# EAGLE design RocketFlightComputer (EAGLE 9.6.2)
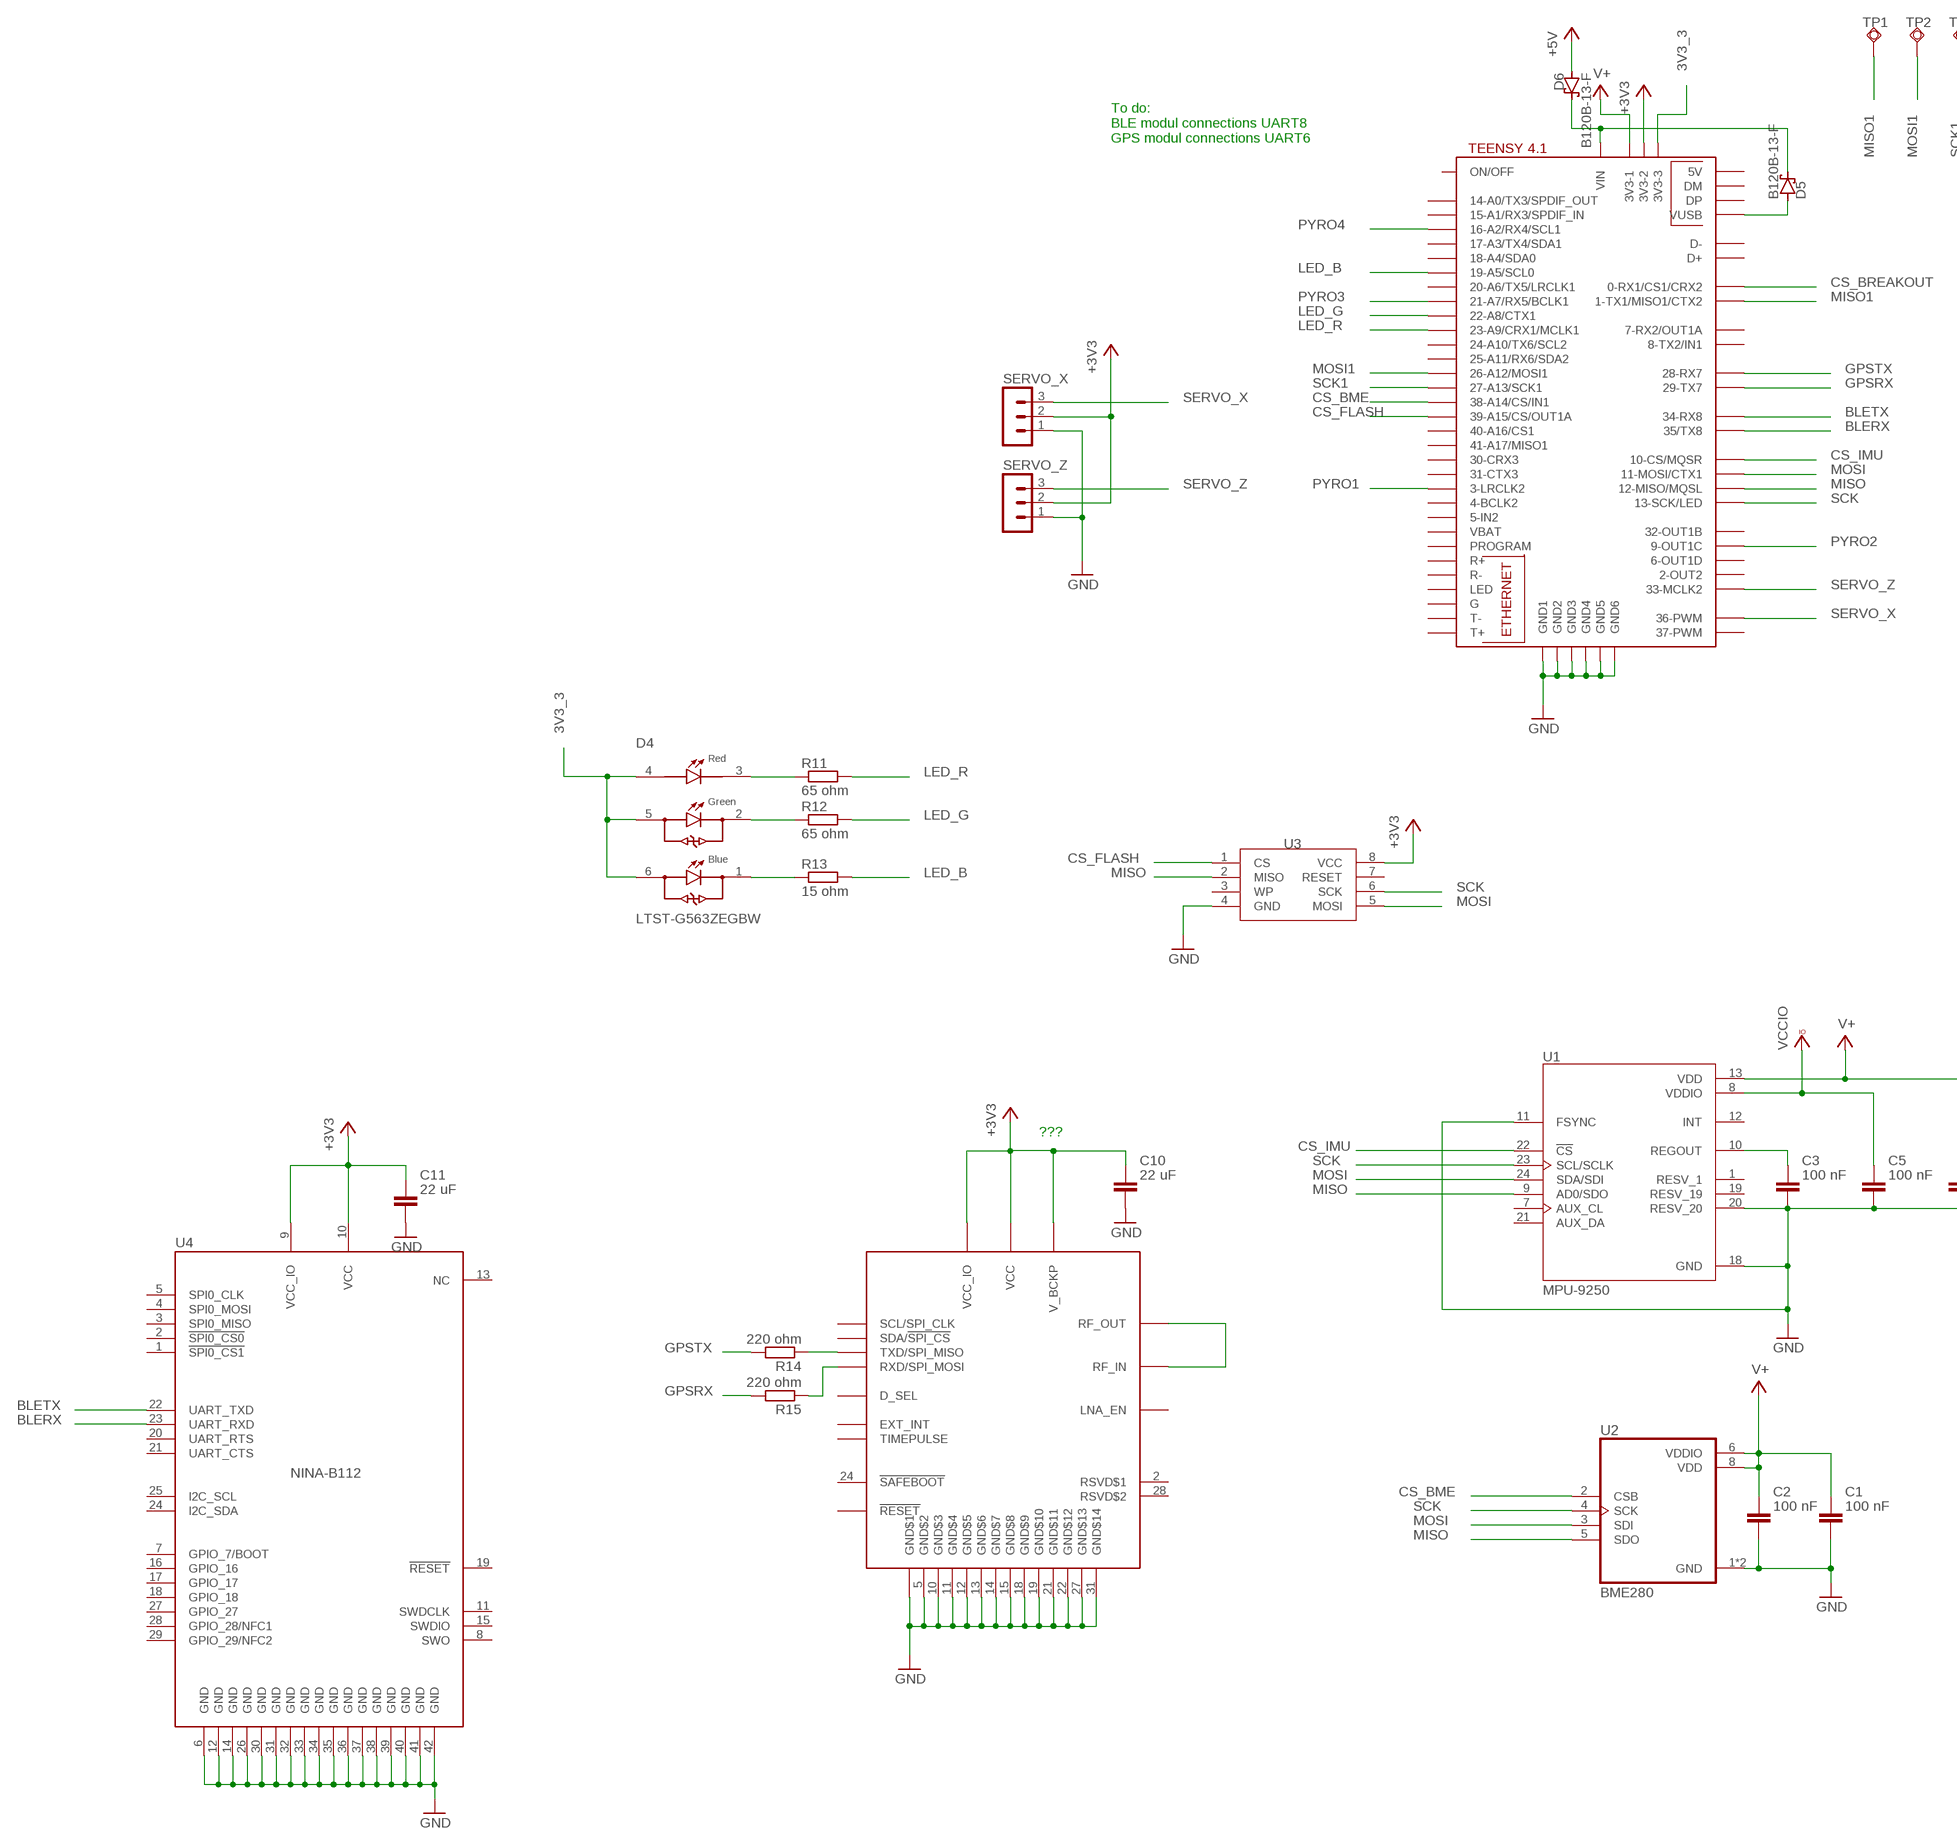
[diagram p0: schematic, sheet 1, part 1 of 2]
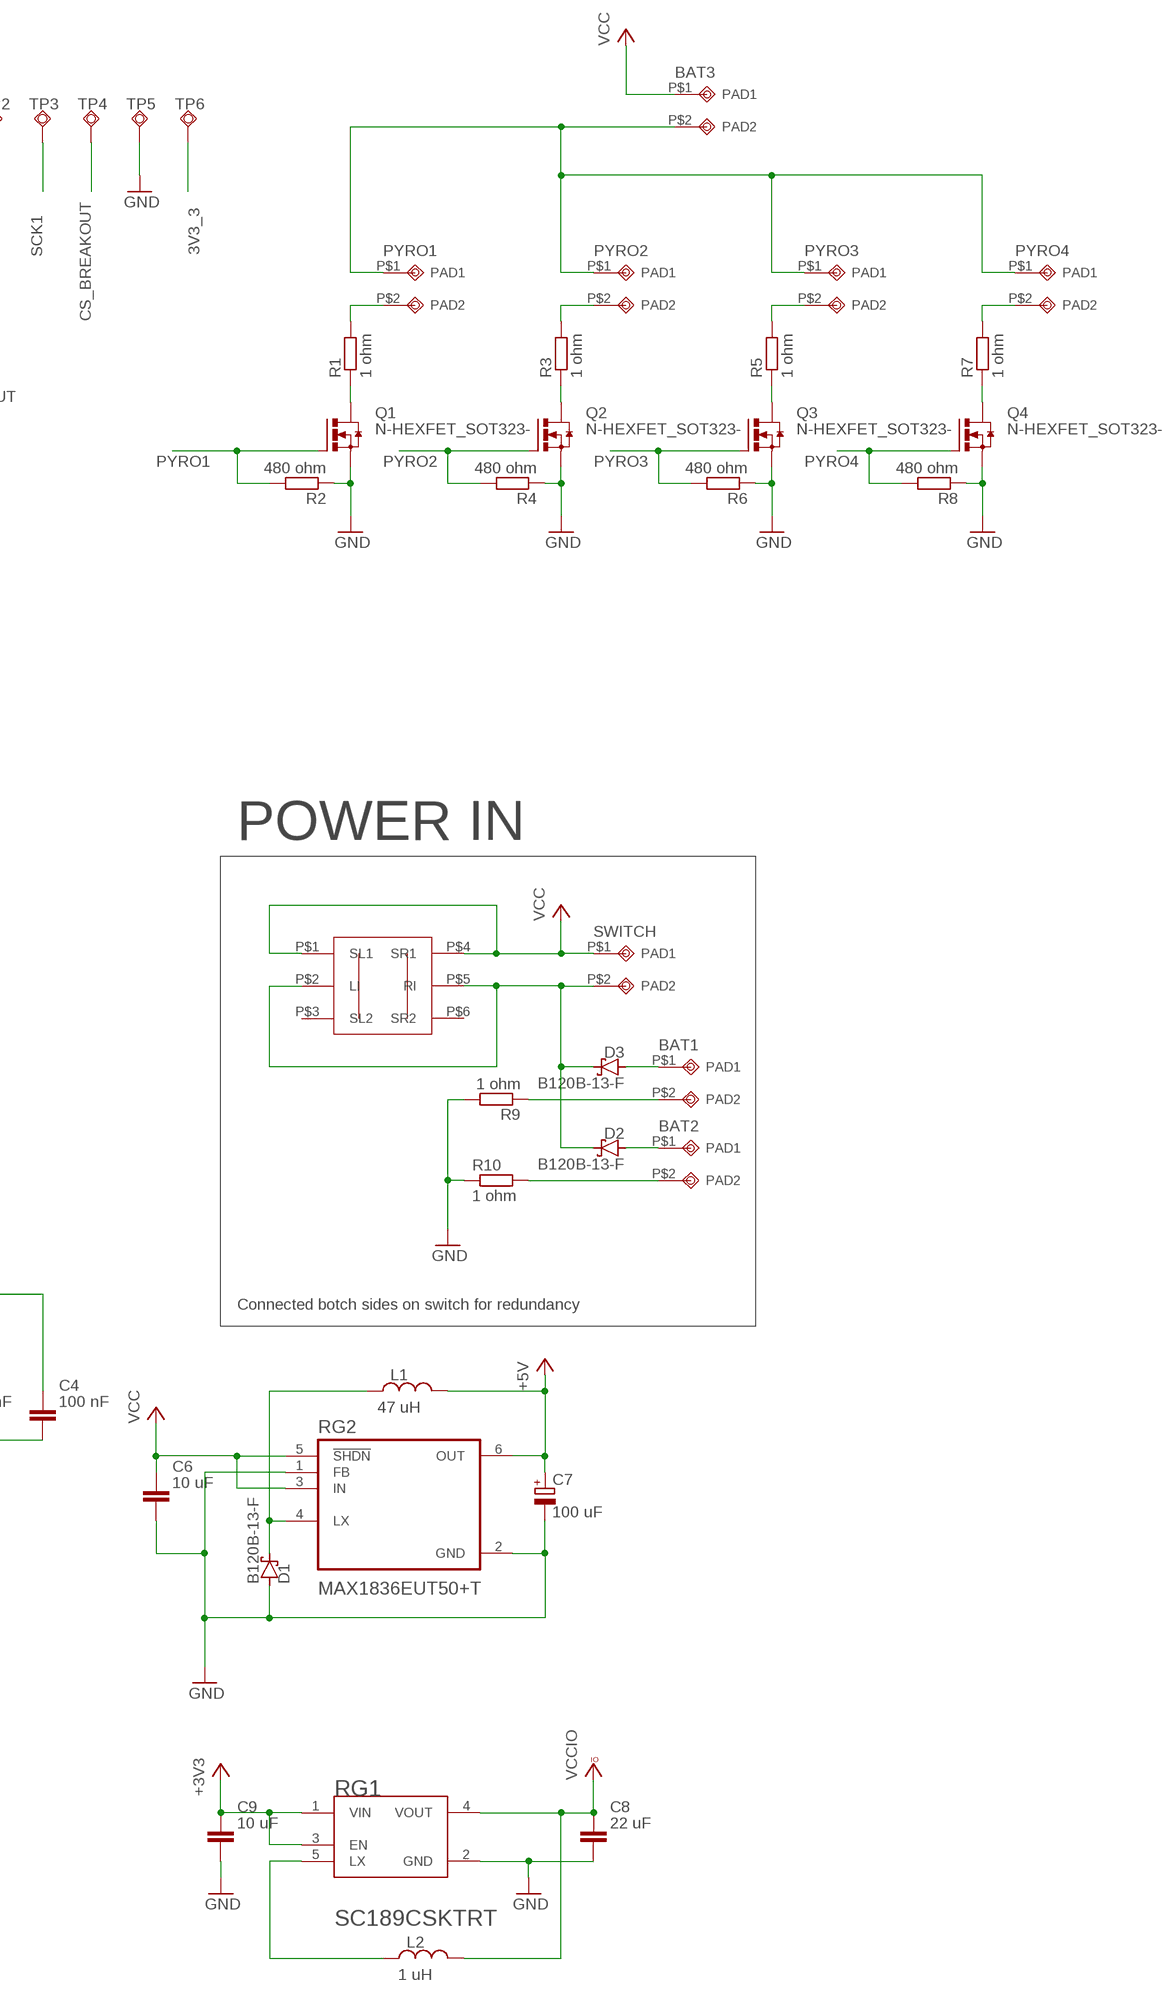
[diagram p1: schematic, sheet 1, part 2 of 2]

## Parts
BAT1  2PINPAD  [2PINPAD]
BAT2  2PINPAD  [2PINPAD]
BAT3  2PINPAD  [2PINPAD]
C1  100 nF  C_CHIP-1206(3216-METRIC)  [CAPC3216X135]
C2  100 nF  C_CHIP-1206(3216-METRIC)  [CAPC3216X135]
C3  100 nF  C_CHIP-1206(3216-METRIC)  [CAPC3216X135]
C4  100 nF  C_CHIP-1206(3216-METRIC)  [CAPC3216X135]
C5  100 nF  C_CHIP-1206(3216-METRIC)  [CAPC3216X135]
C6  10 uF  C_CHIP-1206(3216-METRIC)  [CAPC3216X135]
C7  100 uF  CPOL-EUB/3528-21W  [B/3528-21W]
C8  22 uF  C_CHIP-1206(3216-METRIC)  [CAPC3216X135]
C9  10 uF  C_CHIP-1206(3216-METRIC)  [CAPC3216X135]
C10  22 uF  C_CHIP-1206(3216-METRIC)  [CAPC3216X135]
C11  22 uF  C_CHIP-1206(3216-METRIC)  [CAPC3216X135]
D1  B120B-13-F  [SMB]
D2  B120B-13-F  [SMB]
D3  B120B-13-F  [SMB]
D4  LTST-G563ZEGBW  [LED_LTST-G563ZEGBW]
D5  B120B-13-F  [SMB]
D6  B120B-13-F  [SMB]
L1  47 uH  L_MOLDED-1210(3225-METRIC)  [INDM3225X240]
L2  1 uH  CW0805-10002012  [CAPC2012X110]
PYRO1  2PINPAD  [2PINPAD]
PYRO2  2PINPAD  [2PINPAD]
PYRO3  2PINPAD  [2PINPAD]
PYRO4  2PINPAD  [2PINPAD]
Q1  N-HEXFET_SOT323-  [SOT223]
Q2  N-HEXFET_SOT323-  [SOT223]
Q3  N-HEXFET_SOT323-  [SOT223]
Q4  N-HEXFET_SOT323-  [SOT223]
R1  1 ohm  RR1206  [R1206]
R2  480 ohm  RR1206  [R1206]
R3  1 ohm  RR1206  [R1206]
R4  480 ohm  RR1206  [R1206]
R5  1 ohm  RR1206  [R1206]
R6  480 ohm  RR1206  [R1206]
R7  1 ohm  RR1206  [R1206]
R8  480 ohm  RR1206  [R1206]
R9  1 ohm  RR1206  [R1206]
R10  1 ohm  RR1206  [R1206]
R11  65 ohm  RR1206  [R1206]
R12  65 ohm  RR1206  [R1206]
R13  15 ohm  RR1206  [R1206]
R14  220 ohm  RR1206  [R1206]
R15  220 ohm  RR1206  [R1206]
RG1  SEMTECH_SC189CSKTRTSEMTECH_SC189CSKTRT_0_0  [SEMTECH_SC189CSKTRT_0]
RG2  MAX1836EUT50+T  [SOT95P280X145-6N]
SERVO_X  MA03-1  [MA03-1]
SERVO_Z  MA03-1  [MA03-1]
SWITCH  2PINPAD  [2PINPAD]
TP1  TPSQTP13SQ  [TP13SQ]
TP2  TPSQTP13SQ  [TP13SQ]
TP3  TPSQTP13SQ  [TP13SQ]
TP4  TPSQTP13SQ  [TP13SQ]
TP5  TPSQTP13SQ  [TP13SQ]
TP6  TPSQTP13SQ  [TP13SQ]
U1  MPU-9250  [QFN40P300X300X105-24N]
U2  BME280  [PSON65P250X250X100-8N]
U3  FLASHSOIC8  [SOIC127P600X175-8N]
U4  NINA-B112  [NINA112-42]
U$1  TEENSY41  [TEENSY41]
U$2  CAM-M8  [CAM-M8]
U$3  DUAL_SW  [DUAL_SWITCH]

## Nets
3V3_3: D4.4 D4.5 D4.6 TP6.TP U$1.3V3-3
+3V3: C9.1 C10.1 C11.1 RG1.1(VIN) RG1.3(EN) SERVO_X.2 SERVO_Z.2 U3.8(VCC) U4.9(VCC_IO) U4.10(VCC) U$1.3V3-2 U$2.1(VCC_IO) U$2.8(V_BCKP) U$2.9(VCC)
+5V: C7.+ D6.P$2(A) L1.2 RG2.6(OUT)
BLERX: U4.23(UART_RXD) U$1.35-TX8(35/TX8)
BLETX: U4.22(UART_TXD) U$1.34-RX8
CS_BME: U2.2(CSB) U$1.38-A14/CS/IN1
CS_BREAKOUT: TP4.TP U$1.0-RX1/CS1/CRX2
CS_FLASH: U3.1(CS) U$1.39-A15/CS/OUT1A
CS_IMU: U1.22(!CS) U$1.10-CS\MQSR(10-CS/MQSR)
GND: C1.2 C2.2 C3.2 C4.2 C5.2 C6.2 C7.- C8.2 C9.2 C10.2 C11.2 D1.P$2(A) Q1.3(S) Q2.3(S) Q3.3(S) Q4.3(S) R2.1 R4.1 R6.1 R8.1 R9.2 R10.1 RG1.2(GND) RG2.1(FB) RG2.2(GND) SERVO_X.1 SERVO_Z.1 TP5.TP U1.11(FSYNC) U1.18(GND) U1.20(RESV_20) U2.1(GND) U2.7(GND) U3.4(GND) U4.6(GND) U4.12(GND) U4.14(GND) U4.26(GND) U4.30(GND) U4.31(GND) U4.32(GND) U4.33(GND) U4.34(GND) U4.35(GND) U4.36(GND) U4.37(GND) U4.38(GND) U4.39(GND) U4.40(GND) U4.41(GND) U4.42(GND) U$1.GND1 U$1.GND2 U$1.GND3 U$1.GND4 U$1.GND5 U$1.GND6 U$2.4(GND$1) U$2.5(GND$2) U$2.10(GND$3) U$2.11(GND$4) U$2.12(GND$5) U$2.13(GND$6) U$2.14(GND$7) U$2.15(GND$8) U$2.18(GND$9) U$2.19(GND$10) U$2.21(GND$11) U$2.22(GND$12) U$2.27(GND$13) U$2.31(GND$14)
GPSRX: R15.2 U$1.29-TX7
GPSTX: R14.2 U$1.28-RX7
LED_B: R13.2 U$1.19-A5/SCL0
LED_G: R12.2 U$1.22-A8/CTX1
LED_R: R11.2 U$1.23-A9/CRX1/MCLK1
MISO: U1.9(AD0/SDO) U2.5(SDO) U3.2(MISO) U$1.12-MISO/MQSL
MISO1: TP1.TP U$1.1-TX1/MISO1/CTX2
MOSI: U1.24(SDA/SDI) U2.3(SDI) U3.5(MOSI) U$1.11-MOSI/CTX1
MOSI1: TP2.TP U$1.26-A12/MOSI1
N$1: C3.1 U1.10(REGOUT)
N$2: D5.P$1(B) D6.P$1(B) U$1.VIN
N$3: Q1.4(D) R1.1
N$4: PYRO1.P$2(PAD2) R1.2
N$5: Q2.4(D) R3.1
N$6: PYRO2.P$2(PAD2) R3.2
N$7: D2.P$1(B) D3.P$1(B) SWITCH.P$2(PAD2) U$3.P$2(LI) U$3.P$5(RI)
N$8: D4.3 R11.1
N$9: Q3.4(D) R5.1
N$10: PYRO3.P$2(PAD2) R5.2
N$11: D4.2 R12.1
N$12: Q4.4(D) R7.1
N$13: PYRO4.P$2(PAD2) R7.2
N$14: BAT1.P$2(PAD2) R9.1
N$15: BAT2.P$2(PAD2) R10.2
N$16: D4.1 R13.1
N$17: D1.P$1(B) L1.1 RG2.4(LX)
N$18: BAT2.P$1(PAD1) D2.P$2(A)
N$19: BAT1.P$1(PAD1) D3.P$2(A)
N$20: D5.P$2(A) U$1.VUSB
N$21: U$2.16(RF_OUT) U$2.17(RF_IN)
N$22: L2.1 RG1.5(LX)
N$23: BAT3.P$2(PAD2) PYRO1.P$1(PAD1) PYRO2.P$1(PAD1) PYRO3.P$1(PAD1) PYRO4.P$1(PAD1)
N$24: R14.1 U$2.25(TXD/SPI_MISO)
N$25: R15.1 U$2.26(RXD/SPI_MOSI)
PYRO1: Q1.1(G) R2.2 U$1.3-LRCLK2
PYRO2: Q2.1(G) R4.2 U$1.9-OUT1C
PYRO3: Q3.1(G) R6.2 U$1.21-A7/RX5/BCLK1
PYRO4: Q4.1(G) R8.2 U$1.16-A2/RX4/SCL1
SCK: U1.23(SCL/SCLK) U2.4(SCK) U3.6(SCK) U$1.13-SCK/LED
SCK1: TP3.TP U$1.27-A13/SCK1
SERVO_X: SERVO_X.3 U$1.36-PWM
SERVO_Z: SERVO_Z.3 U$1.33-MCLK2
V+: C1.1 C2.1 C4.1 U1.13(VDD) U2.6(VDDIO) U2.8(VDD) U$1.3V3-1
VCC: BAT3.P$1(PAD1) C6.1 RG2.3(IN) RG2.5(!SHDN) SWITCH.P$1(PAD1) U$3.P$1(SL1) U$3.P$4(SR1)
VCCIO: C5.1 C8.1 L2.2 RG1.4(VOUT) U1.8(VDDIO)
Unconnected: U1.1(RESV_1) U1.7(AUX_CL) U1.12(INT) U1.19(RESV_19) U1.21(AUX_DA) U3.3(WP) U3.7(RESET) U4.1(!SPI0_CS1!) U4.2(!SPI0_CS0) U4.3(SPI0_MISO) U4.4(SPI0_MOSI) U4.5(SPI0_CLK) U4.7(GPIO_7/BOOT) U4.8(SWO) U4.11(SWDCLK) U4.13(NC) U4.15(SWDIO) U4.16(GPIO_16) U4.17(GPIO_17) U4.18(GPIO_18) U4.19(!RESET) U4.20(UART_RTS) U4.21(UART_CTS) U4.24(I2C_SDA) U4.25(I2C_SCL) U4.27(GPIO_27) U4.28(GPIO_28/NFC1) U4.29(GPIO_29/NFC2) U$1.2-OUT2 U$1.4-BCLK2 U$1.5-IN2 U$1.6-OUT1D U$1.7-RX2/OUT1A U$1.8-TX2/IN1 U$1.14-A0/TX3/SPDIF_OUT U$1.15-A1/RX3/SPDIF_IN U$1.17-A3/TX4/SDA1 U$1.18-A4/SDA0 U$1.20-A6/TX5/LRCLK1 U$1.24-A10/TX6/SCL2 U$1.25-A11/RX6/SDA2 U$1.30-CRX3 U$1.31-CTX3 U$1.32-OUT1B U$1.37-PWM U$1.40-A16/CS1 U$1.41-A17/MISO1 U$1.+5V(5V) U$1.D+ U$1.D- U$1.DM U$1.DP U$1.G U$1.LED U$1.ON/OFF U$1.PROGRAM U$1.R+ U$1.R- U$1.T+ U$1.T- U$1.VBAT U$2.2(RSVD$1) U$2.3(SDA/!SPI_CS) U$2.6(SCL/SPI_CLK) U$2.7(EXT_INT) U$2.20(D_SEL) U$2.23(!RESET) U$2.24(!SAFEBOOT) U$2.28(RSVD$2) U$2.29(TIMEPULSE) U$2.30(LNA_EN) U$3.P$3(SL2) U$3.P$6(SR2)

## Notes on the sheet
- To do:
  BLE modul connections UART8
  GPS modul connections UART6
- POWER IN
- Connected botch sides on switch for redundancy
- ???

## Library data of the parts
BAT1-BAT3 PYRO1-PYRO4 SWITCH = SolderPads:2PINPAD: 2x SMD solder pad 0,5 mm x 1 mm
C1-C6 C8-C11 = Capacitor:C: Capacitor - Generic; CATEGORY: Capacitor
C7 = rcl:CPOL-EU: POLARIZED CAPACITOR, European symbol; SPICEPREFIX: C
D1-D3 D5 D6 = DroneCustomParts:B120B-13-F
D4 = LTST-G563ZEGBW:LTST-G563ZEGBW: LED; SMD; 5050, PLCC6; RGB; 5x5x1.6mm; 120°; 20mA; Lens: transparent Check prices <https://pricing.snapeda.com/parts/LTST-G563ZEGBW/Lite-On/view-part?ref=eda>; AVAILABILITY: In Stock; DESCRIPTION: LED; SMD; 5050, PLCC6; RGB; 5x5x1.6mm; 120°; 20mA; Lens: transparent; MF: Lite-On; MP: LTST-G563ZEGBW; PACKAGE: PLCC-6 Lite-On; PRICE: None
L1 = Inductor:L: Inductor Fixed - Generic; CATEGORY: Inductor; SUB-CATEGORY: Fixed
L2 = CW0805-1000:CW0805-1000
Q1-Q4 = transistor-power:N-HEXFET_?-*: HEXFET® Power MOSFET
R1-R15 = eagle-ltspice:R: RESISTOR, European symbol; SPICEMODEL: NONE; SPICEPREFIX: R
RG1 = Semtech - SC189CSKTRT:SEMTECH_SC189CSKTRT: 2.5MHz, 1.5A Synchronous Step Down Regulator; CENTROID_NOT_SPECIFIED: No; DATASHEET: http://www.semtech.com/images/datasheet/sc189.pdf; DIGIKEY_DESCRIPTION: REG IC REG BUCK 1.2V 1.5A SYNC SOT23; DIGIKEY_PART_NUMBER: SC189CSKCT-ND; LEAD_FREE: yes; MF: Semtech; MOUSER_PART_NUMBER: 947-SC189CSKTRT; MPN: SC189CSKTRT; PACKAGE: SOT23-5; PREFIX: RG; ROHS: yes; TEMPERATURE_RANGE_HIGH: +85°C; TEMPERATURE_RANGE_LOW: -40°C
RG2 = MAX1836EUT50_T:MAX1836EUT50+T: Check prices <https://pricing.snapeda.com/parts/MAX1836EUT50%2BT/Maxim%20Integrated/view-part?ref=eda>; AVAILABILITY: In Stock; DESCRIPTION: Buck Switching Regulator IC Positive Fixed 5V 1 Output 125mA SOT-23-6; MF: Maxim Integrated; MP: MAX1836EUT50+T; PACKAGE: SOT-23-6 Maxim; PRICE: None; PURCHASE-URL: https://pricing.snapeda.com/search/part/MAX1836EUT50+T/?ref=eda
SERVO_X SERVO_Z = con-lstb:MA03-1: PIN HEADER; OC_FARNELL: unknown; OC_NEWARK: unknown
TP1-TP6 = testpad:TPSQ: Test pad
U1 = MPU-9250:MPU-9250: Axis=3 Axis Gyro+3 Axis Accel+Compass. Pin For Pin With m Check prices <https://pricing.snapeda.com/parts/MPU-9250/TDK%20InvenSense/view-part?ref=eda>; AVAILABILITY: Bad; DESCRIPTION: Accelerometer, Gyroscope, Magnetometer, 9 Axis Sensor I²C, SPI Output; MF: TDK InvenSense; MP: MPU-9250; PACKAGE: TFQFN-24 TDK InvenSense; PRICE: None
U2 = BME280:BME280: DIGITAL HUMIDITY, PRESSURE AND TEMPERATURE SENSOR * Digital interface I²C (up to 3.4 MHz) and SPI (3 and 4 wire, up to 10 MHz)* Supply voltage VDD main supply voltage range: 1.71 V to 3.6 V*VDDIO interface voltage range: 1.2 V to 3.6 V Operating range -40…+85 °C, 0…100 % rel. humidity, 300…1100 hPa The library has been designed by Richard Magdycz <https://www.facebook.com/groups/eaglecadsoftUK> Check prices <https://pricing.snapeda.com/parts/BME280/Bosch/view-part?ref=eda>; AVAILABILITY: Good; DESCRIPTION: Humidity Temperature Sensor 0 ~ 100% RH I²C, SPI ±3% 1s Surface Mount; MF: Bosch; MP: BME280; PACKAGE: LGA-8 Bosch; PRICE: None; PURCHASE-URL: https://pricing.snapeda.com/search/part/BME280/?ref=eda
U3 = Flahs:FLASH
U4 = ubloxLib:NINA-B112: NINA-B112: BLE stand-alone module u-blox.com
U$1 = teensy:TEENSY41
U$2 = ubloxLib:CAM-M8: CAM-M8x: M8 Concurrent GNSS Antenna Module u-blox.com
U$3 = switch:DUAL_SW

## Board
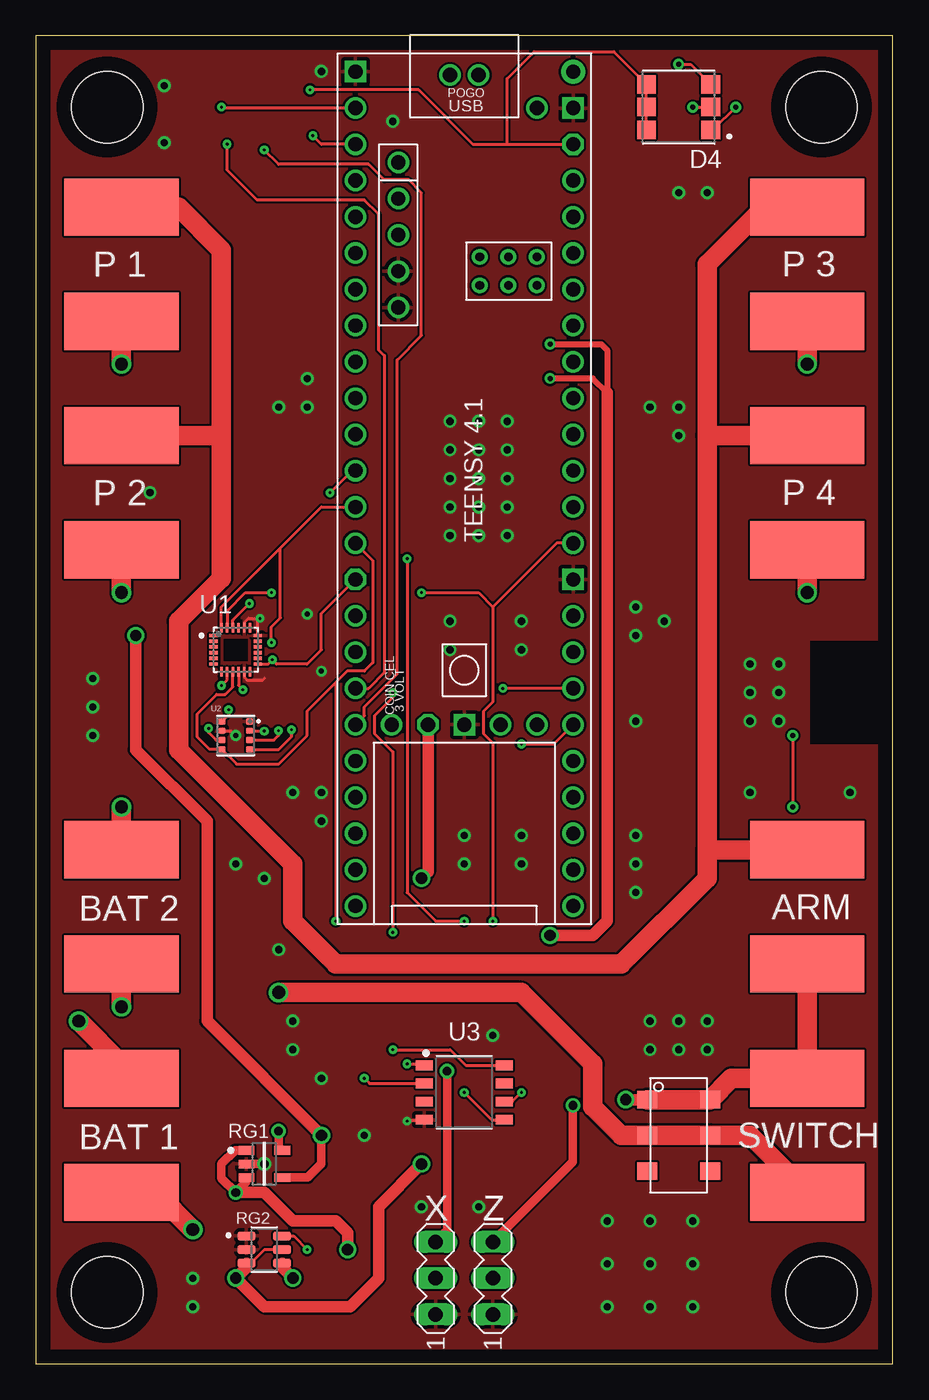
[diagram p2: board, top side]
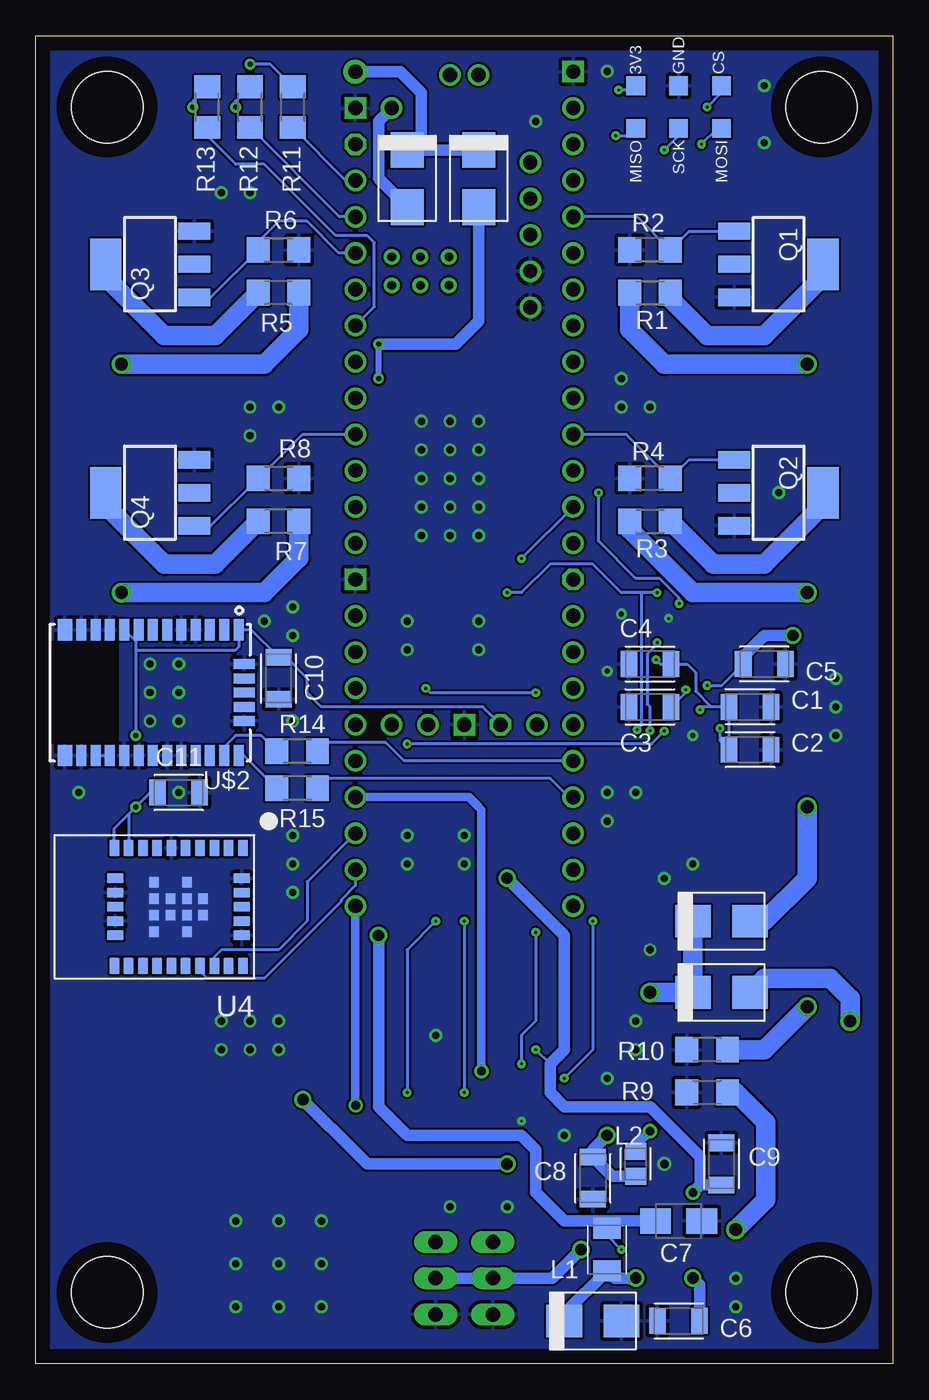
[diagram p3: board, bottom side, seen from below]

Size 60 x 93 mm. Coordinates in mm from the lower left corner, seen from the top.
Outline: 0,0 60,0 60,93 0,93 0,0
Copper layers (1*16): Top 0.035mm / dielectric 1.5mm / Bottom 0.035mm
Design rules "default *": minimum track width 6mil, minimum drill 0.2mm, track to track 6mil, track to pad 6mil, pad to pad 6mil, via to via 6mil, smd to smd 6mil, copper to edge 40mil, drill to drill 6mil, minimum pad ring 10mil, minimum via ring 8mil, stop-mask expansion 4mil, vias tented up to drill 20mil, thermal gap 10mil
Holes 5 mm at 5,88 55,88 5,5 55,5

### Footprints (pad centres in the part's own frame; a part is rotated, then mirrored left to right if it is on the bottom)
2PINPAD = smd 8 x 4: P$1 0,4; P$2 0,-4
CAPC3216X135 = smd 1.165 x 1.815: 1 -1.475,0; 2 1.475,0
B/3528-21W = smd 2.15 x 1.8: + 1.625,0; - -1.625,0
SMB = smd 2.5 x 2.3: P$1 -2,0; P$2 2,0
LED_LTST-G563ZEGBW = smd 1.3 x 1.3: 1 -2.25,1.6; 2 -2.25,0; 3 -2.25,-1.6; 4 2.25,-1.6; 5 2.25,0; 6 2.25,1.6
INDM3225X240 = smd 1.459 x 1.929: 1 -1.478,0; 2 1.478,0
CAPC2012X110 = smd 1.165 x 1.465: 1 -0.875,0; 2 0.875,0
SOT223 = smd 1.219 x 2.235: 1 -2.311,-3.099; 2 0,-3.099; 3 2.311,-3.099 | smd 3.6 x 2.2: 4 0,3.099
R1206 = smd 1.6 x 1.803: 1 -1.422,0; 2 1.422,0
SEMTECH_SC189CSKTRT_0 = smd 1.1 x 0.6: 1 -1.25,0.95; 2 -1.25,0; 3 -1.25,-0.95; 4 1.25,-0.95; 5 1.25,0.95
SOT95P280X145-6N = smd 1.22 x 0.6: 1 -1.245,0.95; 2 -1.245,0; 3 -1.245,-0.95; 4 1.245,-0.95; 5 1.245,0; 6 1.245,0.95
MA03-1 = drill 1.016 long: 1 -2.54,0; 2 0,0; 3 2.54,0
TP13SQ = smd 1.3 x 1.3: TP 0,0
QFN40P300X300X105-24N = smd 0.64 x 0.22: 1 -1.545,1; 2 -1.545,0.6; 3 -1.545,0.2; 4 -1.545,-0.2; 5 -1.545,-0.6; 6 -1.545,-1; 13 1.545,-1; 14 1.545,-0.6; 15 1.545,-0.2; 16 1.545,0.2; 17 1.545,0.6; 18 1.545,1 | smd 0.22 x 0.64: 7 -1,-1.545; 8 -0.6,-1.545; 9 -0.2,-1.545; 10 0.2,-1.545; 11 0.6,-1.545; 12 1,-1.545; 19 1,1.545; 20 0.6,1.545; 21 0.2,1.545; 22 -0.2,1.545; 23 -0.6,1.545; 24 -1,1.545
PSON65P250X250X100-8N = smd 0.49 x 0.45: 1 0.97,0.975; 2 0.97,0.325; 3 0.97,-0.325; 4 0.97,-0.975; 5 -0.97,-0.975; 6 -0.97,-0.325; 7 -0.97,0.325; 8 -0.97,0.975
SOIC127P600X175-8N = smd 1.212 x 0.682: 1 -2.8,1.905; 2 -2.8,0.635; 3 -2.8,-0.635; 4 -2.8,-1.905; 5 2.8,-1.905; 6 2.8,-0.635; 7 2.8,0.635; 8 2.8,1.905
NINA112-42 = smd 0.7 x 1.15: 1 -4.5,-4.125; 2 -3.5,-4.125; 3 -2.5,-4.125; 4 -1.5,-4.125; 5 -0.5,-4.125; 6 0.5,-4.125; 7 1.5,-4.125; 8 2.5,-4.125; 9 3.5,-4.125; 10 4.5,-4.125; 16 4.5,4.125; 17 3.5,4.125; 18 2.5,4.125; 19 1.5,4.125; 20 0.5,4.125; 21 -0.5,4.125; 22 -1.5,4.125; 23 -2.5,4.125; 24 -3.5,4.125; 25 -4.5,4.125 | smd 1.15 x 0.7: 11 4.425,-2; 12 4.425,-1; 13 4.425,0; 14 4.425,1; 15 4.425,2; 26 -4.425,2; 27 -4.425,1; 28 -4.425,0; 29 -4.425,-1; 30 -4.425,-2 | smd 0.7 x 0.7: 31 -1.725,-0.575; 32 -1.725,0.575; 33 -0.575,-1.725; 34 -0.575,-0.575; 35 -0.575,0.575; 36 -0.575,1.725; 37 0.575,-0.575; 38 0.575,0.575; 39 1.725,-1.725; 40 1.725,-0.575; 41 1.725,0.575; 42 1.725,1.725
TEENSY41 = drill 1: 0-RX1/CS1/CRX2 -27.94,-7.62; 1-TX1/MISO1/CTX2 -25.4,-7.62; 2-OUT2 -22.86,-7.62; 3-LRCLK2 -20.32,-7.62; 4-BCLK2 -17.78,-7.62; 5-IN2 -15.24,-7.62; 6-OUT1D -12.7,-7.62; 7-RX2/OUT1A -10.16,-7.62; 8-TX2/IN1 -7.62,-7.62; 9-OUT1C -5.08,-7.62; 10-CS\MQSR -2.54,-7.62; 11-MOSI/CTX1 0,-7.62; 12-MISO/MQSL 2.54,-7.62; 13-SCK/LED 2.54,7.62; 14-A0/TX3/SPDIF_OUT 0,7.62; 15-A1/RX3/SPDIF_IN -2.54,7.62; 16-A2/RX4/SCL1 -5.08,7.62; 17-A3/TX4/SDA1 -7.62,7.62; 18-A4/SDA0 -10.16,7.62; 19-A5/SCL0 -12.7,7.62; 20-A6/TX5/LRCLK1 -15.24,7.62; 21-A7/RX5/BCLK1 -17.78,7.62; 22-A8/CTX1 -20.32,7.62; 23-A9/CRX1/MCLK1 -22.86,7.62; 24-A10/TX6/SCL2 7.62,-7.62; 25-A11/RX6/SDA2 10.16,-7.62; 26-A12/MOSI1 12.7,-7.62; 27-A13/SCK1 15.24,-7.62; 28-RX7 17.78,-7.62; 29-TX7 20.32,-7.62; 30-CRX3 22.86,-7.62; 31-CTX3 25.4,-7.62; 32-OUT1B 27.94,-7.62; 33-MCLK2 27.94,7.62; 34-RX8 25.4,7.62; 35-TX8 22.86,7.62; 36-PWM 20.32,7.62; 37-PWM 17.78,7.62; 38-A14/CS/IN1 15.24,7.62; 39-A15/CS/OUT1A 12.7,7.62; 40-A16/CS1 10.16,7.62; 41-A17/MISO1 7.62,7.62; +5V -24.13,-4.62; D+ -30.25,-1; D- -30.25,1; DM -21.59,-4.62; DP -19.05,-4.62; GND4 -16.51,-4.62; GND5 -13.97,-4.62; ON/OFF 15.24,5.08; PROGRAM 15.24,2.54; VBAT 15.24,-5.08; VUSB -27.94,5.08 | drill 1 octagon: 3V3-1 5.08,-7.62; 3V3-2 15.24,-2.54; 3V3-3 -25.4,7.62 | drill 0.6: G -15.51,3.08; LED -17.51,3.08; R+ -17.51,5.08; R- -15.51,5.08; T+ -15.51,1.08; T- -17.51,1.08 | drill 1 square: GND1 -30.48,-7.62; GND2 15.24,0; GND3 5.08,7.62; GND6 -27.94,7.62 | drill 1 pad 1.676: VIN -30.48,7.62
CAM-M8 = smd 0.7 x 1.5: 1 -6.2,-4.4; 2 -5.2,-4.4; 3 -4.2,-4.4; 4 -3.2,-4.4; 5 -2.2,-4.4; 6 -1.2,-4.4; 7 -0.2,-4.4; 8 0.8,-4.4; 9 1.8,-4.4; 10 2.8,-4.4; 11 3.8,-4.4; 12 4.8,-4.4; 15 4.8,4.4; 16 3.8,4.4; 17 2.8,4.4; 18 1.8,4.4; 19 0.8,4.4; 20 -0.2,4.4; 21 -1.2,4.4; 22 -2.2,4.4; 23 -3.2,4.4; 24 -4.2,4.4; 25 -5.2,4.4; 26 -6.2,4.4 | smd 1 x 1.5: 13 5.95,-4.4; 14 5.95,4.4 | smd 1.5 x 0.7: 27 -6.6,2; 28 -6.6,1; 29 -6.6,0; 30 -6.6,-1; 31 -6.6,-2
DUAL_SWITCH = smd 1.2 x 1.4: P$1 -2.5,-2.2; P$2 0,-2.2; P$3 2.5,-2.2; P$4 -2.5,2.2; P$5 0,2.2; P$6 2.5,2.2

### Placement (x,y rotation side)
BAT1  6,16 0 top
BAT2  6,32 0 top
BAT3  54,32 180 top
C1  10,46 0 bottom
C2  10,43 0 bottom
C3  17,46 180 bottom
C4  17,49 180 bottom
C5  9,49 0 bottom
C6  15,3 180 bottom
C7  15,10 180 bottom
C8  21,13 270 bottom
C9  12,14 90 bottom
C10  43,48 270 bottom
C11  50,40 0 bottom
D1  21,3 0 bottom
D2  12,31 0 bottom
D3  12,26 0 bottom
D4  45,88 180 top
D5  34,83 270 bottom
D6  29,83 270 bottom
L1  20,8 90 bottom
L2  18,14 270 bottom
PYRO1  6,77 0 top
PYRO2  6,61 0 top
PYRO3  54,77 0 top
PYRO4  54,61 0 top
Q1  8,77 270 bottom
Q2  8,61 270 bottom
Q3  52,77 90 bottom
Q4  52,61 90 bottom
R1  17,75 180 bottom
R2  17,78 0 bottom
R3  17,59 180 bottom
R4  17,62 0 bottom
R5  43,75 0 bottom
R6  43,78 180 bottom
R7  43,59 0 bottom
R8  43,62 180 bottom
R9  13,19 180 bottom
R10  13,22 0 bottom
R11  42,88 270 bottom
R12  45,88 270 bottom
R13  48,88 270 bottom
R14  41.7,42.9 0 bottom
R15  41.7,40.3 0 bottom
RG1  16,14 0 top
RG2  16,8 0 top
SERVO_X  28,6 90 top
SERVO_Z  32,6 90 top
SWITCH  54,16 0 top
TP1  18,86.5 0 bottom
TP2  12,86.5 0 bottom
TP3  15,86.5 0 bottom
TP4  12,89.5 0 bottom
TP5  15,89.5 0 bottom
TP6  18,89.5 0 bottom
U1  14,50 0 top
U2  14,44 0 top
U3  30,19 0 top
U4  50,32 180 bottom
U$1  30,60 270 top
U$2  52,47 180 bottom
U$3  45,16 270 top

### Tracks (layer width: path | path; a pad name or v marks a point on that pad's centre or on a via)
3V3_3  (via drill 0.2)
  Top 0.2: v19.2,89.2 26.8,89.2 30.6,85.4 33,85.4 | 33,85.4 U$1.3V3-3 | 33,85.4 33,90 34.88,91.88 40.47,91.88 D4.4 D4.5 D4.6
  Bottom 0.2: v19.2,89.2 18.3,89.2 TP6.TP
+3V3  (via drill 0.2, 0.35, 0.6, 0.8)
  Top 0.2: U3.8 30.09,20.91 29,22 v25,22 | v53,44 v53,39
  Top 0.61: RG1.1 13.95,14.95 13,14 13,13 v14,12 14.75,12.75 RG1.3
  Top 0.813: U$1.3V3-2 27.46,34.46 v27,34 | v14,12 16,12 18,10 21,10 21.84,9.16 v21.84,8
  Bottom 0.2: 24,21 v25,22 | 53.5,38.5 v53,39 52,40 C11.1 | 53.5,38.5 U4.9 | U4.10 54.5,37.5 53.5,38.5 | U$2.8 53,51.2 53,50.6 | 53,50.6 53,50 | 53,50 v53,44 | 53,50.6 U$2.9 | U$1.3V3-2 28.7,46 40,46 41,47 41,48 42.48,49.48 C10.1 44.92,51.4 U$2.1 45.8,50.2 46,50 53,50
  Bottom 0.813: C9.1 13.48,12.52 | 13.48,12.52 v14,12 | v27,34 23,30 23,22 24,21 24,19 23,18 17,18 13.48,14.48 13.48,12.52 | v21.84,8 23.84,6 SERVO_X.2 SERVO_Z.2
+5V  (via drill 0.2, 0.35, 0.8)
  Top 0.2: RG2.6 18.05,8.95 v19,8
  Top 0.406: v36,69 39,69 40,68 40,71 39.6,71.4 v36,71.4
  Top 0.813: v36,30 39,30 40,31 40,68
  Bottom 0.2: v19,8 20,9 L1.2
  Bottom 0.406: v36,69 v36,71.4
  Bottom 0.813: C7.+ 19.48,10 | 19.48,10 L1.2 | v36,30 36,18 34,16 26,16 25,15 25,12 23,10 19.48,10 | v36,71.4 30.6,71.4 29,73 D6.P$2
BLERX
  Bottom 0.2: U$1.35-TX8 41,33.76 41,31 43,29 46,29 46.5,29 47,29 47.5,28.5 U4.23
BLETX
  Bottom 0.2: U$1.34-RX8 37.62,33.48 38.63,32.48 38.63,32.37 44,27 48,27 48.5,27.5 U4.22
CS_BME  (via drill 0.2)
  Top 0.2: U2.2 15.98,44.33 v16,44.31 | v34,43.4 36.26,43.4 U$1.38-A14/CS/IN1
  Bottom 0.2: v16,44.31 16.91,43.4 v34,43.4
CS_BREAKOUT  (via drill 0.2)
  Top 0.2: U$1.0-RX1/CS1/CRX2 13.06,87.94 v13,88
  Bottom 0.2: v13,88 12,89 TP4.TP
CS_FLASH  (via drill 0.2)
  Top 0.2: v25,30.22 25,42.86 23.71,44.14 23.71,45.38 25,46.66 v25,47 | v26,21 27.1,21 U3.1 | U$1.39-A15/CS/OUT1A v32.7,47.3
  Bottom 0.2: v25,30.22 25,24 26,23 v26,21 | v32.7,47.3 32.4,47 v25,47
CS_IMU  (via drill 0.2)
  Top 0.2: U1.22 13.8,52.08 v14.96,53.24 | v20.6,61 22.14,62.54 U$1.10-CS\MQSR
  Bottom 0.2: v14.96,53.24 14.96,53.63 16.33,55 18,55 20.6,57.6 v20.6,61
GND  (via drill 0.2, 0.35, 0.5, 0.6)
  Top 0.2: U3.4 27.1,17 v26,17 | U2.7 13.67,44.33 v14,44
  Top 0.203: U1.11 14.6,48.08 14.8,47.88 15.88,47.88 16,48 | U1.18 15.55,52.05 v15.7,52.2 14.88,52.2 14.64,51.95 14.64,51.58 U1.20
  Top 0.61: RG1.2 v16,14
  other vias: 20,48.5 31,62 31,60 29,50 34,50 42,45 50,47 40,7 27,11 18,22 4,46 17,67 8,61 43,67 47,82 18,40 34,35 31,11 14,35 23,16 11,6 20,90.5 9,85.5 46,7 46,4 40,4 43,4 43,7 45,24 43,24 42,35 42,33 45,67 19,67 19,69 33,60 33,62 33,64 31,64 4,44 4,48 20,40 20,38 16,34 18,24 20,20 11,4 52,47 45,82 29,52 34,52 34,37 30,37 30,35 32,23 17,29 40,10 43,10 46,10 47,24 47,22 45,22 43,22 50,40 44,52 45,65 29,64 29,62 29,60 29,58 31,58 33,58 29,66 31,66 33,66 42,53 42,51 50,49 52,49 52,45 50,45 42,37 57,40 9,89.5 19,52.5 25,87
  pour Bottom: -2,95 -2,-3 61,-3 61,94 60,95 -1,95
  pour Top: -8,95 -8,-1 63,-1 63,95
GPSRX
  Bottom 0.2: U$1.29-TX7 22.68,39.68 24,41 39.58,41 R15.2
GPSTX
  Bottom 0.2: U$1.28-RX7 34.22,42.22 35.5,43.5 39.68,43.5 R14.2
LED_B
  Bottom 0.2: U$1.19-A5/SCL0 36.3,74.02 36.3,78.5 36.8,79 39,79 44,84 46,84 48,86 R13.2
LED_G
  Bottom 0.2: U$1.22-A8/CTX1 38.74,80.32 R12.2
LED_R
  Bottom 0.2: U$1.23-A9/CRX1/MCLK1 38.28,82.86 R11.2
MISO  (via drill 0.2)
  Top 0.2: 21,47.7 19,45.7 19,44 17,42 14.05,42 U2.5 12.17,43.02 11.3,43.9 11.3,45.5 12.67,46.87 13.26,46.87 13.8,47.41 U1.9 | 21,47.7 v21,31 | v23,20 23.37,19.63 U3.2 | U$1.12-MISO/MQSL 23.6,56.24 23.6,49.1 23,48.5 21.8,48.5 21,47.7
  Bottom 0.2: v21,31 21,22 v23,20
MISO1  (via drill 0.2)
  Top 0.2: U$1.1-TX1/MISO1/CTX2 20,85.4 v19.4,86
  Bottom 0.2: v19.4,86 18.5,86 TP1.TP
MOSI  (via drill 0.2)
  Top 0.2: U1.24 13,53 17.13,57.13 | U$1.11-MOSI/CTX1 20,60 17.13,57.13 | v30,19 31.91,17.09 U3.5 | v26,56.38 26,33 28,31 v30,31 | U2.3 16.67,43.67 16.99,43.99 v16.99,44.33 | v16.5,50.5 16.5,51.61 17.13,52.24 17.13,57.13
  Bottom 0.2: v30,31 v30,19 | v16.99,44.33 16.99,45.99 17.2,46.2 17.2,49.7 16.5,50.4 v16.5,50.5 | U$1.11-MOSI/CTX1 v26,56.38
MOSI1  (via drill 0.2)
  Top 0.2: U$1.26-A12/MOSI1 23.3,47.3 24.4,48.4 24.4,70.6 24,71 24,80.5 23,81.5 15.5,81.5 13.4,83.6 v13.4,85.4
  Bottom 0.2: v13.4,85.4 12.3,86.5 TP2.TP
N$1  (via drill 0.2)
  Top 0.2: U1.10 14.2,47.5 v14.5,47.2
  Bottom 0.2: C3.1 14.5,47.02 v14.5,47.2
N$2
  Bottom 0.813: D6.P$1 33,85 | 33,85 D5.P$1 | 33,85 33,89 34.48,90.48 U$1.VIN
N$3
  Bottom 1.37: R1.1 15.58,74.58 13,72 9,72 4.9,76.1 Q1.4
N$4  (via drill 0.9)
  Top 1.37: PYRO1.P$2 v6,70
  Bottom 1.37: R1.2 18.42,72.42 16,70 v6,70
N$5
  Bottom 1.37: R3.1 12.58,56 9,56 4.9,60.1 Q2.4
N$6  (via drill 0.9)
  Top 1.37: PYRO2.P$2 v6,54
  Bottom 1.37: v6,54 14,54 18.42,58.42 R3.2
N$7  (via drill 0.9)
  Top 1.37: v17,26 34,26 39,21 39,18 41,16 U$3.P$2 U$3.P$5 50,16 SWITCH.P$2
  Bottom 1.37: v17,26 D3.P$1 D2.P$1
N$8  (via drill 0.35)
  Top 0.2: v45,91 45.85,91 D4.3
  Bottom 0.2: R11.1 43.58,91 v45,91
N$9
  Bottom 1.37: R5.1 47.42,72 51,72 55.1,76.1 Q3.4
N$10  (via drill 0.9)
  Top 1.37: PYRO3.P$2 v54,70
  Bottom 1.37: v54,70 44,70 41.58,72.42 R5.2
N$11  (via drill 0.35)
  Top 0.2: v46,88 D4.2
  Bottom 0.2: R12.1 46,88.42 v46,88
N$12
  Bottom 1.37: R7.1 47.42,56 51,56 55.1,60.1 Q4.4
N$13  (via drill 0.9)
  Top 1.37: PYRO4.P$2 v54,54
  Bottom 1.37: v54,54 44,54 41.58,56.42 R7.2
N$14  (via drill 0.9)
  Top 1.37: BAT1.P$2 8.4,12 v11,9.4
  Bottom 1.37: v11,9.4 8.9,11.5 8.9,16.9 11,19 R9.1
N$15  (via drill 0.9)
  Top 1.37: BAT2.P$2 v6,25
  Bottom 1.37: v6,25 9,22 R10.2
N$16  (via drill 0.35)
  Top 0.2: v49,88 47.4,86.4 D4.1
  Bottom 0.2: R13.1 49,88.42 v49,88
N$17  (via drill 0.8)
  Top 0.813: RG2.4 17.24,6.75 v18,6
  Bottom 0.813: v18,6 19.48,6 L1.1 23,3.52 D1.P$1
N$18  (via drill 0.9)
  Top 1.37: v6,39 BAT2.P$1
  Bottom 1.37: D2.P$2 9,31 6,34 v6,39
N$19  (via drill 0.9)
  Top 1.37: v3,24 6,21 BAT1.P$1
  Bottom 1.37: D3.P$2 9,27 4.4,27 3,25.6 v3,24
N$20
  Bottom 0.813: U$1.VUSB 36,87.02 36,83 D5.P$2
N$21
  Bottom 0.2: U$2.16 U$2.17
N$22  (via drill 0.6)
  Top 0.61: RG1.5 17,15.2 v17,16.3
  Bottom 0.61: v17,16.3 18,15.3 L2.1
N$23
  Top 1.37: PYRO3.P$1 51,81 47,77 47,65 | 47,65 47,36 | 47,36 BAT3.P$2 | PYRO4.P$1 47,65 | PYRO1.P$1 10,81 13,78 13,65 | 13,65 13,55 10,52 10,43 18,35 18,31 21,28 41,28 47,34 47,36 | PYRO2.P$1 13,65
N$24
  Bottom 0.2: R14.1 44.22,44 46,44 46.8,43.2 U$2.25
N$25
  Bottom 0.2: U$2.26 45.42,42.6 R15.1
PYRO1
  Bottom 0.2: Q1.1 14.27,79.31 R2.2 17.9,80.32 U$1.3-LRCLK2
PYRO2
  Bottom 0.2: Q2.1 14.27,63.31 R4.2 18.66,65.08 U$1.9-OUT1C
PYRO3
  Bottom 0.2: Q3.1 47.73,74.69 R6.2 44.42,78.58 43,80 41,80 38.78,77.78 U$1.21-A7/RX5/BCLK1
PYRO4
  Bottom 0.2: Q4.1 47.73,58.69 44.71,61.71 R8.2 41.34,65.08 U$1.16-A2/RX4/SCL1
SCK  (via drill 0.2)
  Top 0.2: U$1.13-SCK/LED 36.46,57.46 32,53 | v34,19 33.37,18.36 U3.6 | 32,53 32,46.34 31.33,45.68 31.33,44.14 32,43.48 v32,31 | U1.23 13.44,51.58 13.44,52.75 14.68,54 v16.5,54 | v27,54 31,54 32,53 | U2.4 17.02,43.02 17.9,43.9 v17.9,44.4
  Bottom 0.2: v32,31 34,29 v34,19 | v16.5,54 17.6,54 | v27,54 26,54 24,56 21,56 19,54 17.6,54 | 17.6,54 17.6,44.7 v17.9,44.4
SCK1  (via drill 0.2)
  Top 0.2: U$1.27-A13/SCK1 23,45.38 23,46 25.3,48.3 25.3,70.3 27,72 27,82 26.1,82.9 24.4,82.9 23.3,84 17,84 v16,85
  Bottom 0.2: v16,85 15,86 TP3.TP
SERVO_X  (via drill 0.6)
  Top 0.61: v28.8,20.5 28.8,9.34 SERVO_X.3
  Bottom 0.61: v28.8,20.5 28.8,38.8 29,39 29.68,39.68 U$1.36-PWM
SERVO_Z  (via drill 0.6)
  Top 0.61: v37.6,18.1 37.6,14.14 SERVO_Z.3
  Bottom 0.61: U$1.33-MCLK2 37.62,18.12 v37.6,18.1
V+  (via drill 0.2)
  Top 0.2: U2.6 12.62,43.67 12.1,44.2 v12.1,44.5 | U$1.3V3-1 20,52.54 20,50 19,49 16.87,49 v16.57,49.3 16.27,49 U1.13 | v13.5,45.8 13.5,45.45 U2.8
  Bottom 0.2: 12.7,46 13.8,47.1 13.8,48.4 14.4,49 C4.1 16.27,49 v16.57,49.3 | 12.7,46 C1.1 C2.1 12.1,43.62 v12.1,44.5 | 12.7,46 13.3,46 v13.5,45.8
VCC  (via drill 0.8)
  Top 0.2: RG2.5 16,8 15.05,7.05 RG2.3
  Top 0.813: RG2.3 14.76,6.75 v14,6 16,4 22,4 24,6 24,11 v27,14 | v41.3,18.5 U$3.P$1
  Top 1.37: U$3.P$1 U$3.P$4 48.7,20 SWITCH.P$1 BAT3.P$1
  Bottom 0.813: v41.3,18.5 37.4,14.6 36.8,14 v27,14 | C6.1 13.52,5.52 v14,6
VCCIO  (via drill 0.2, 0.8)
  Top 0.2: v13,47.5 13.4,47.9 U1.8
  Top 0.61: RG1.4 19.05,13.05 20,14 v20,16
  Top 0.813: v20,16 12,24 12,38 7,43 v7,51
  Bottom 0.2: v13,47.5 11.98,47.5 C5.1
  Bottom 0.813: L2.2 19.65,13.12 C8.1 21,15 v20,16 | v7,51 9,51 10.48,49.52 C5.1

### Text on the board
tNames: P 3 | P 1 | P 4 | P 2 | BAT 2 | ARM | BAT 1 | SWITCH | X | Z
bNames: CS | GND | 3V3 | MOSI | SCK | MISO